# EAGLE schematic ra-08h_development_board_V1.0-20230228 (EAGLE 9.5.1)
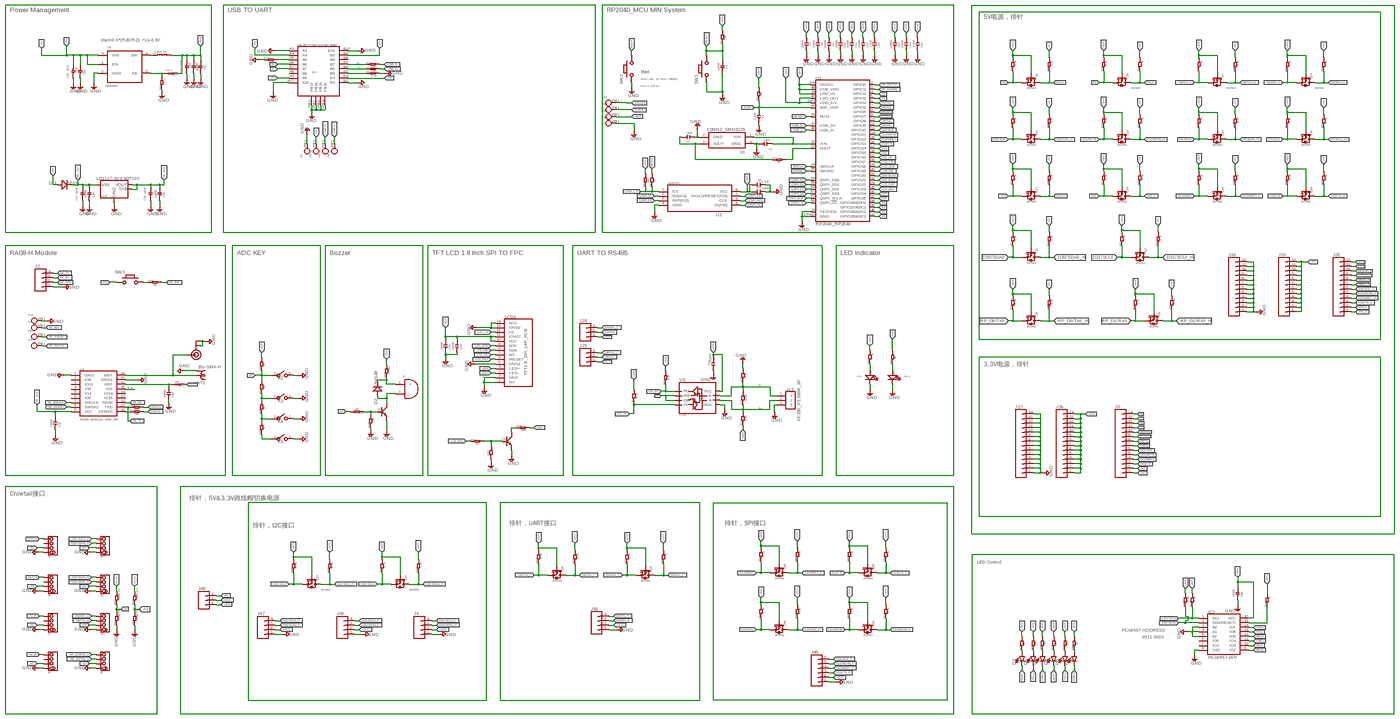
[diagram p0: schematic, sheet 1, overview]
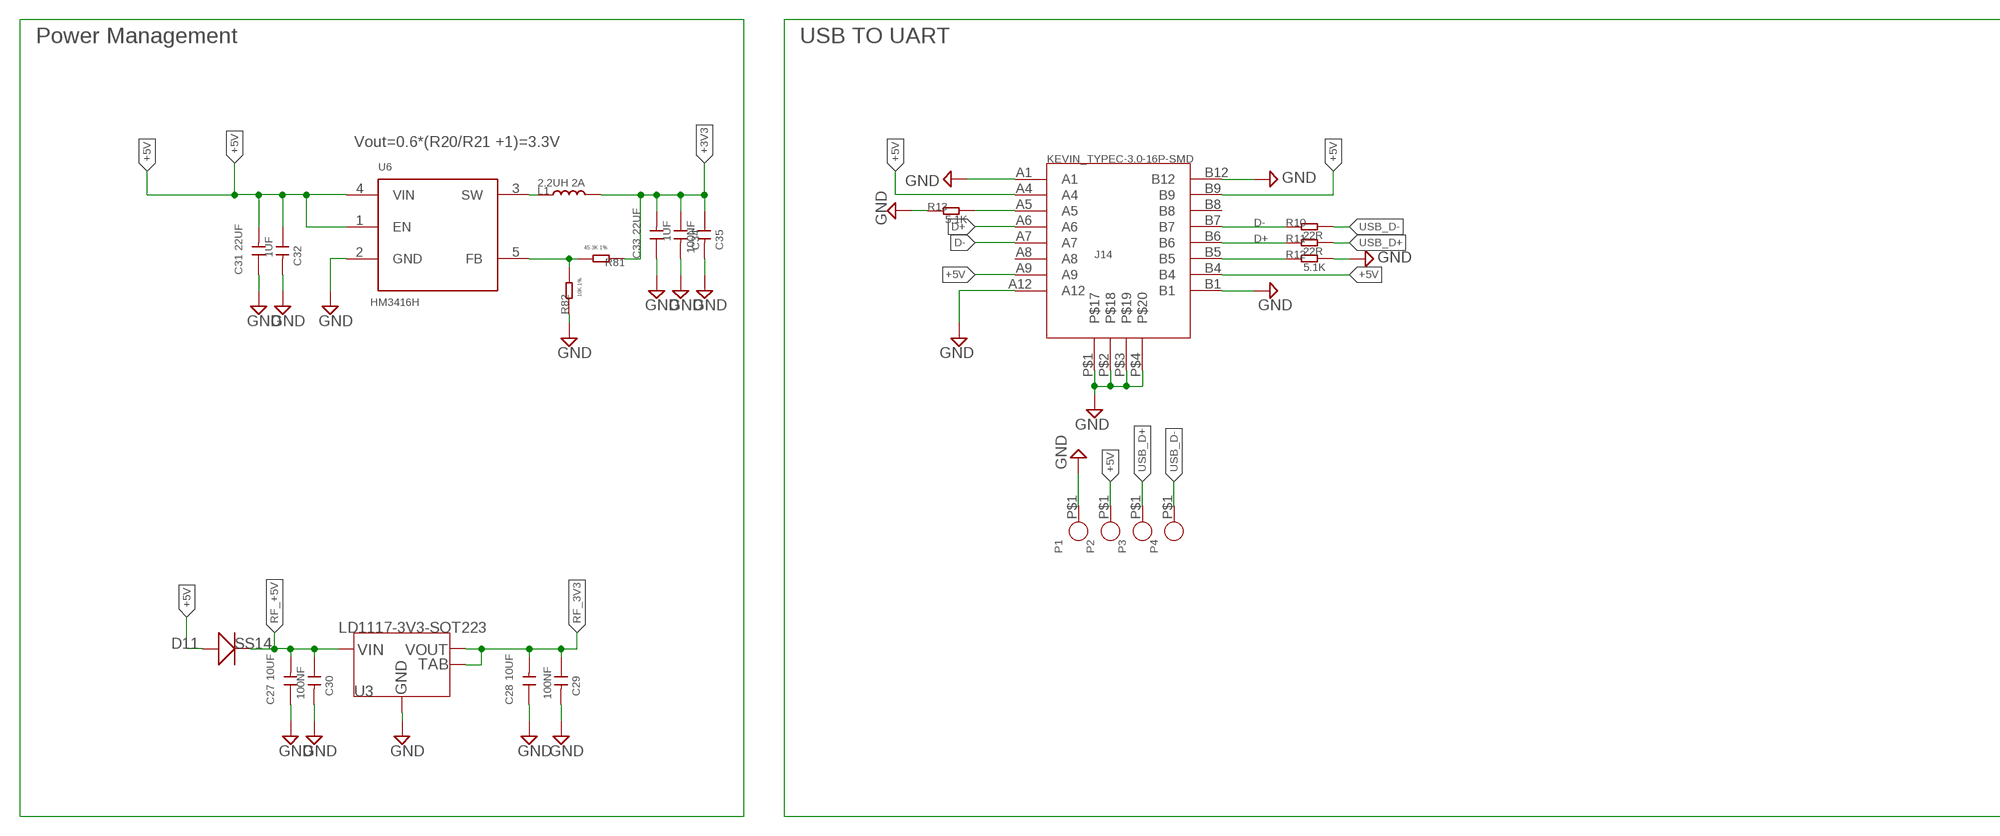
[diagram p1: schematic, sheet 1, part 1 of 6]
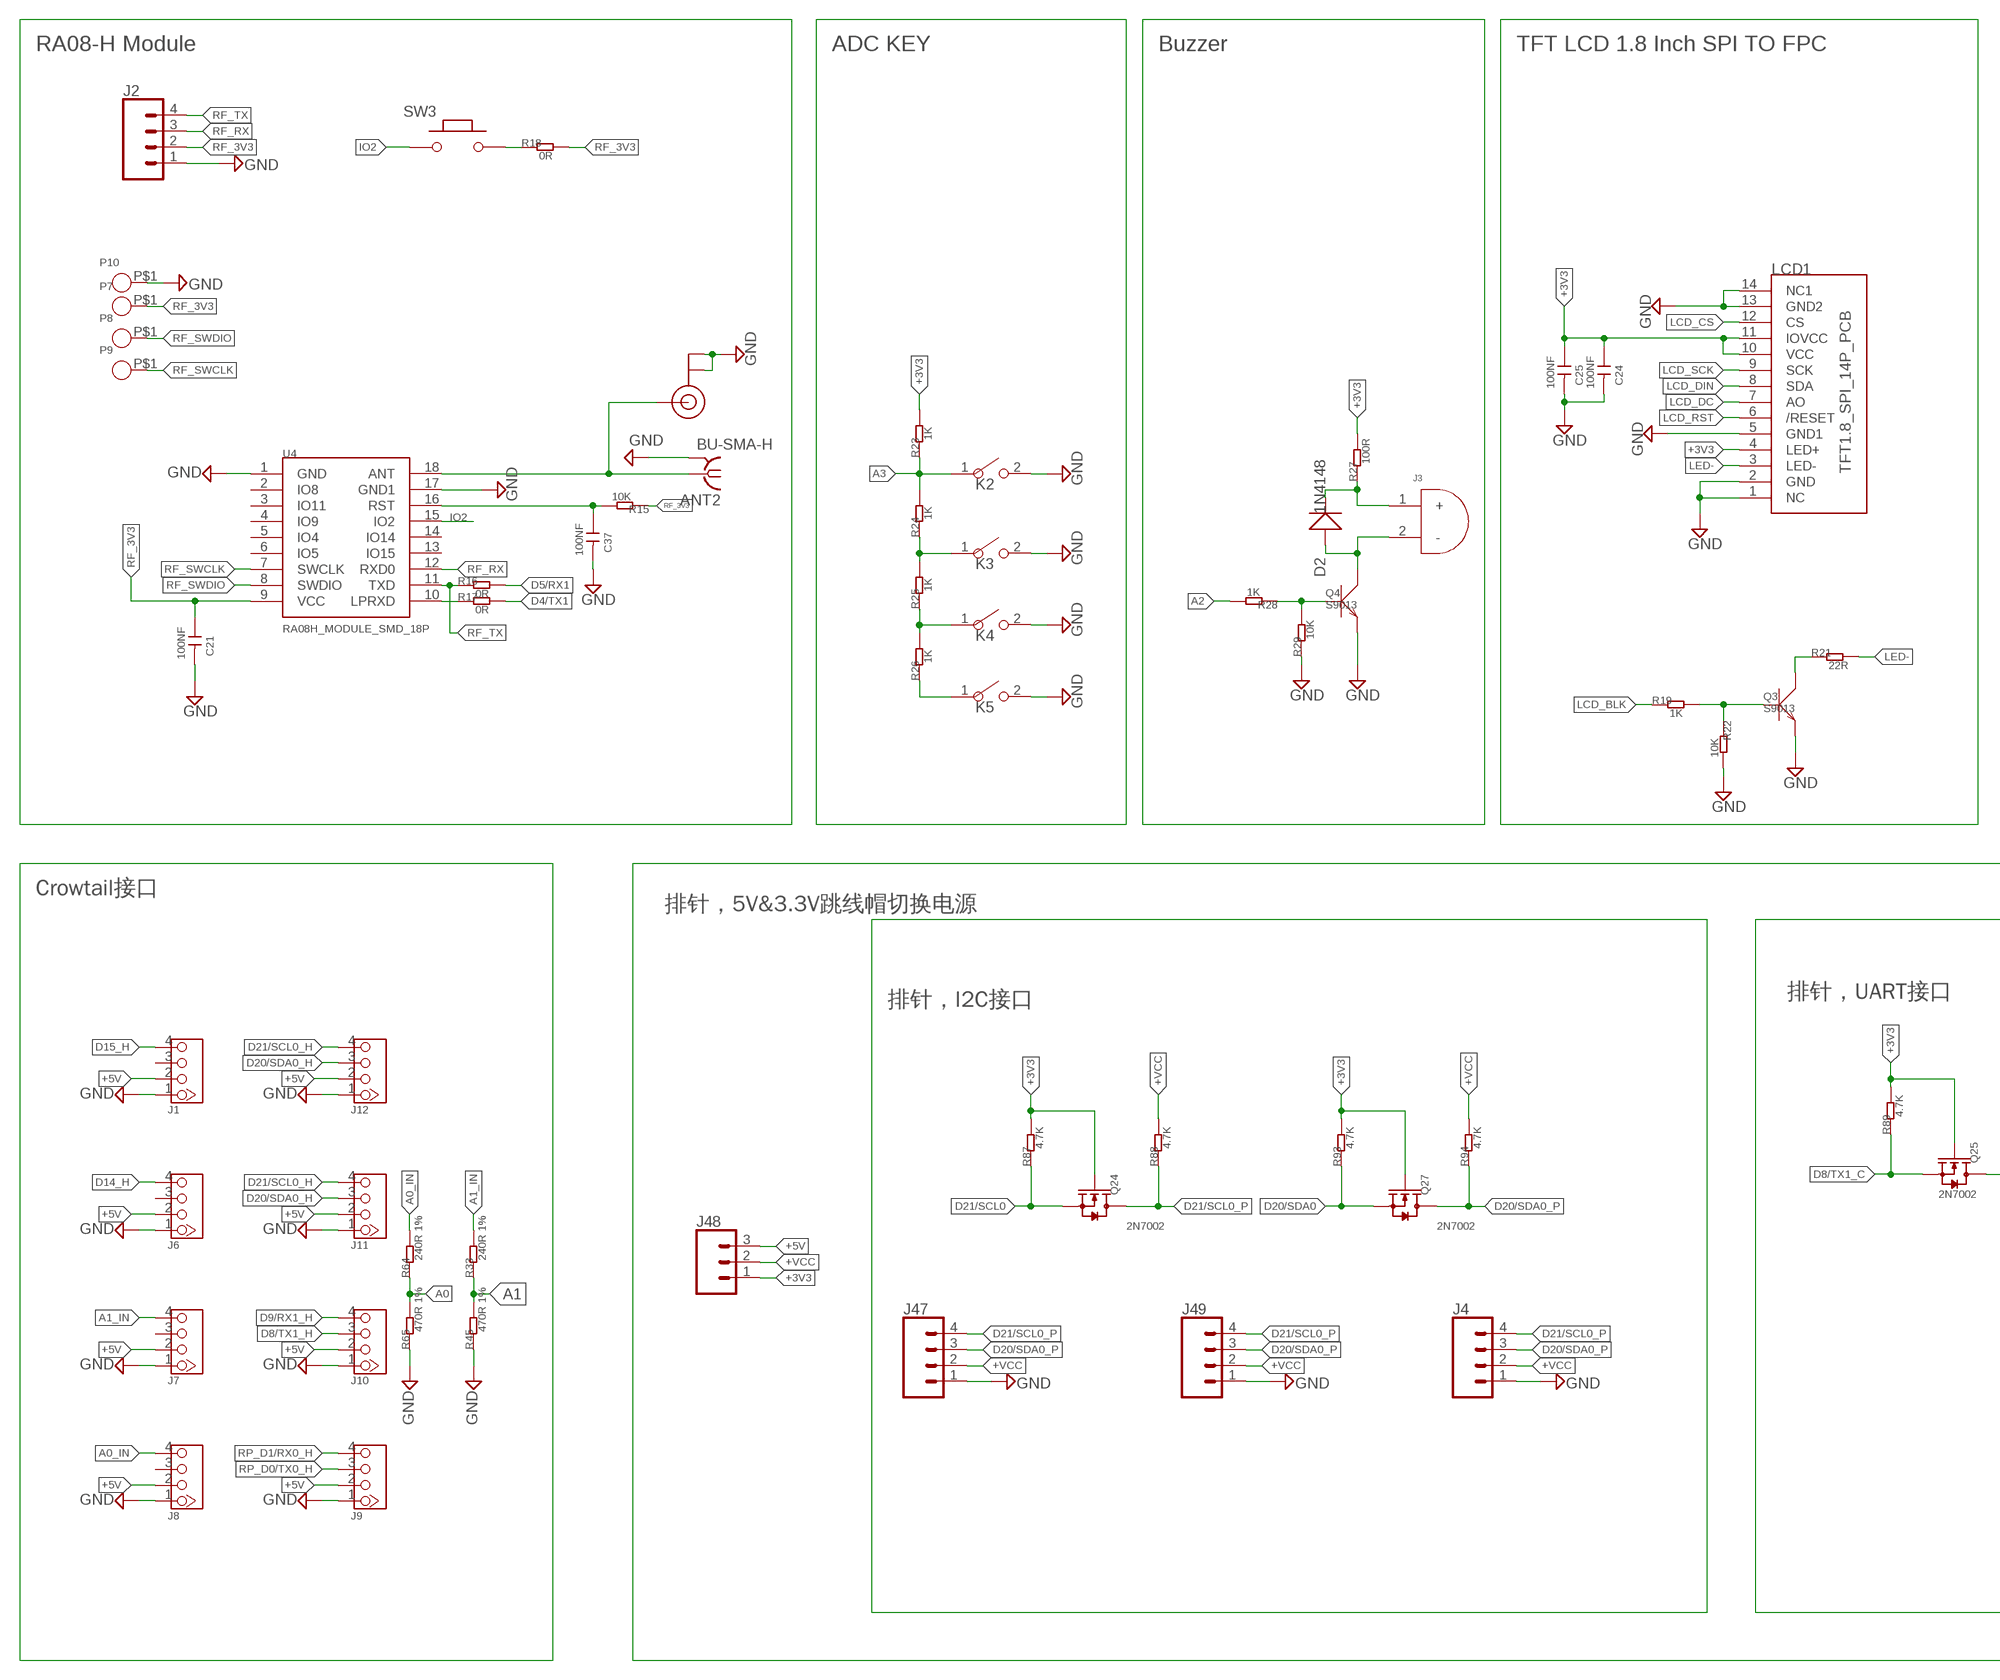
[diagram p2: schematic, sheet 1, part 2 of 6]
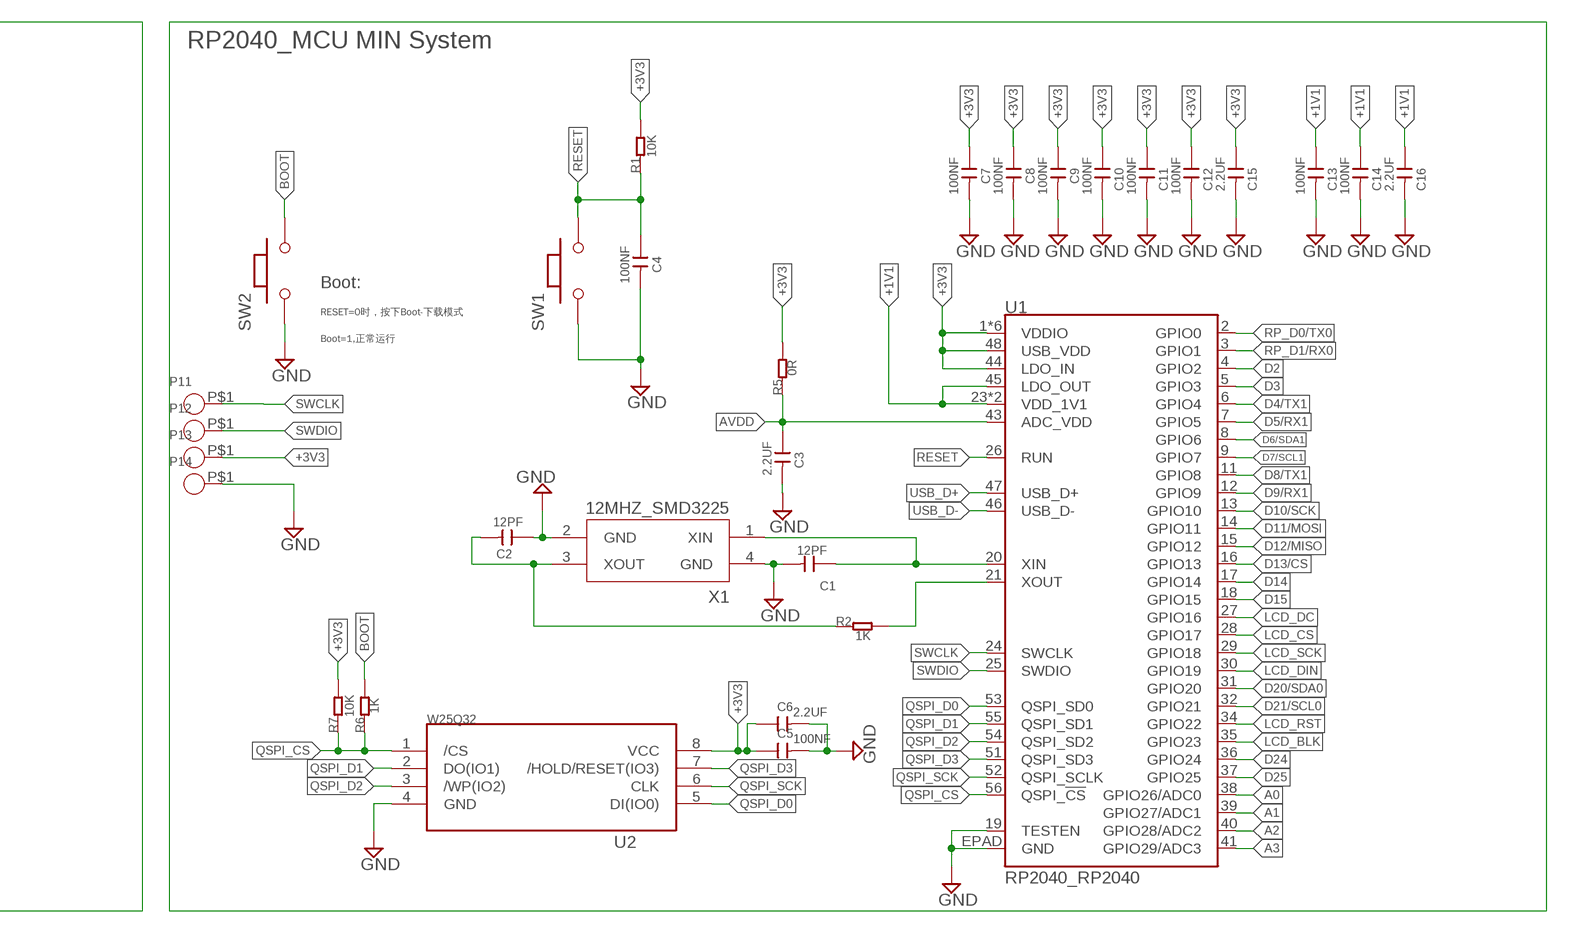
[diagram p3: schematic, sheet 1, part 3 of 6]
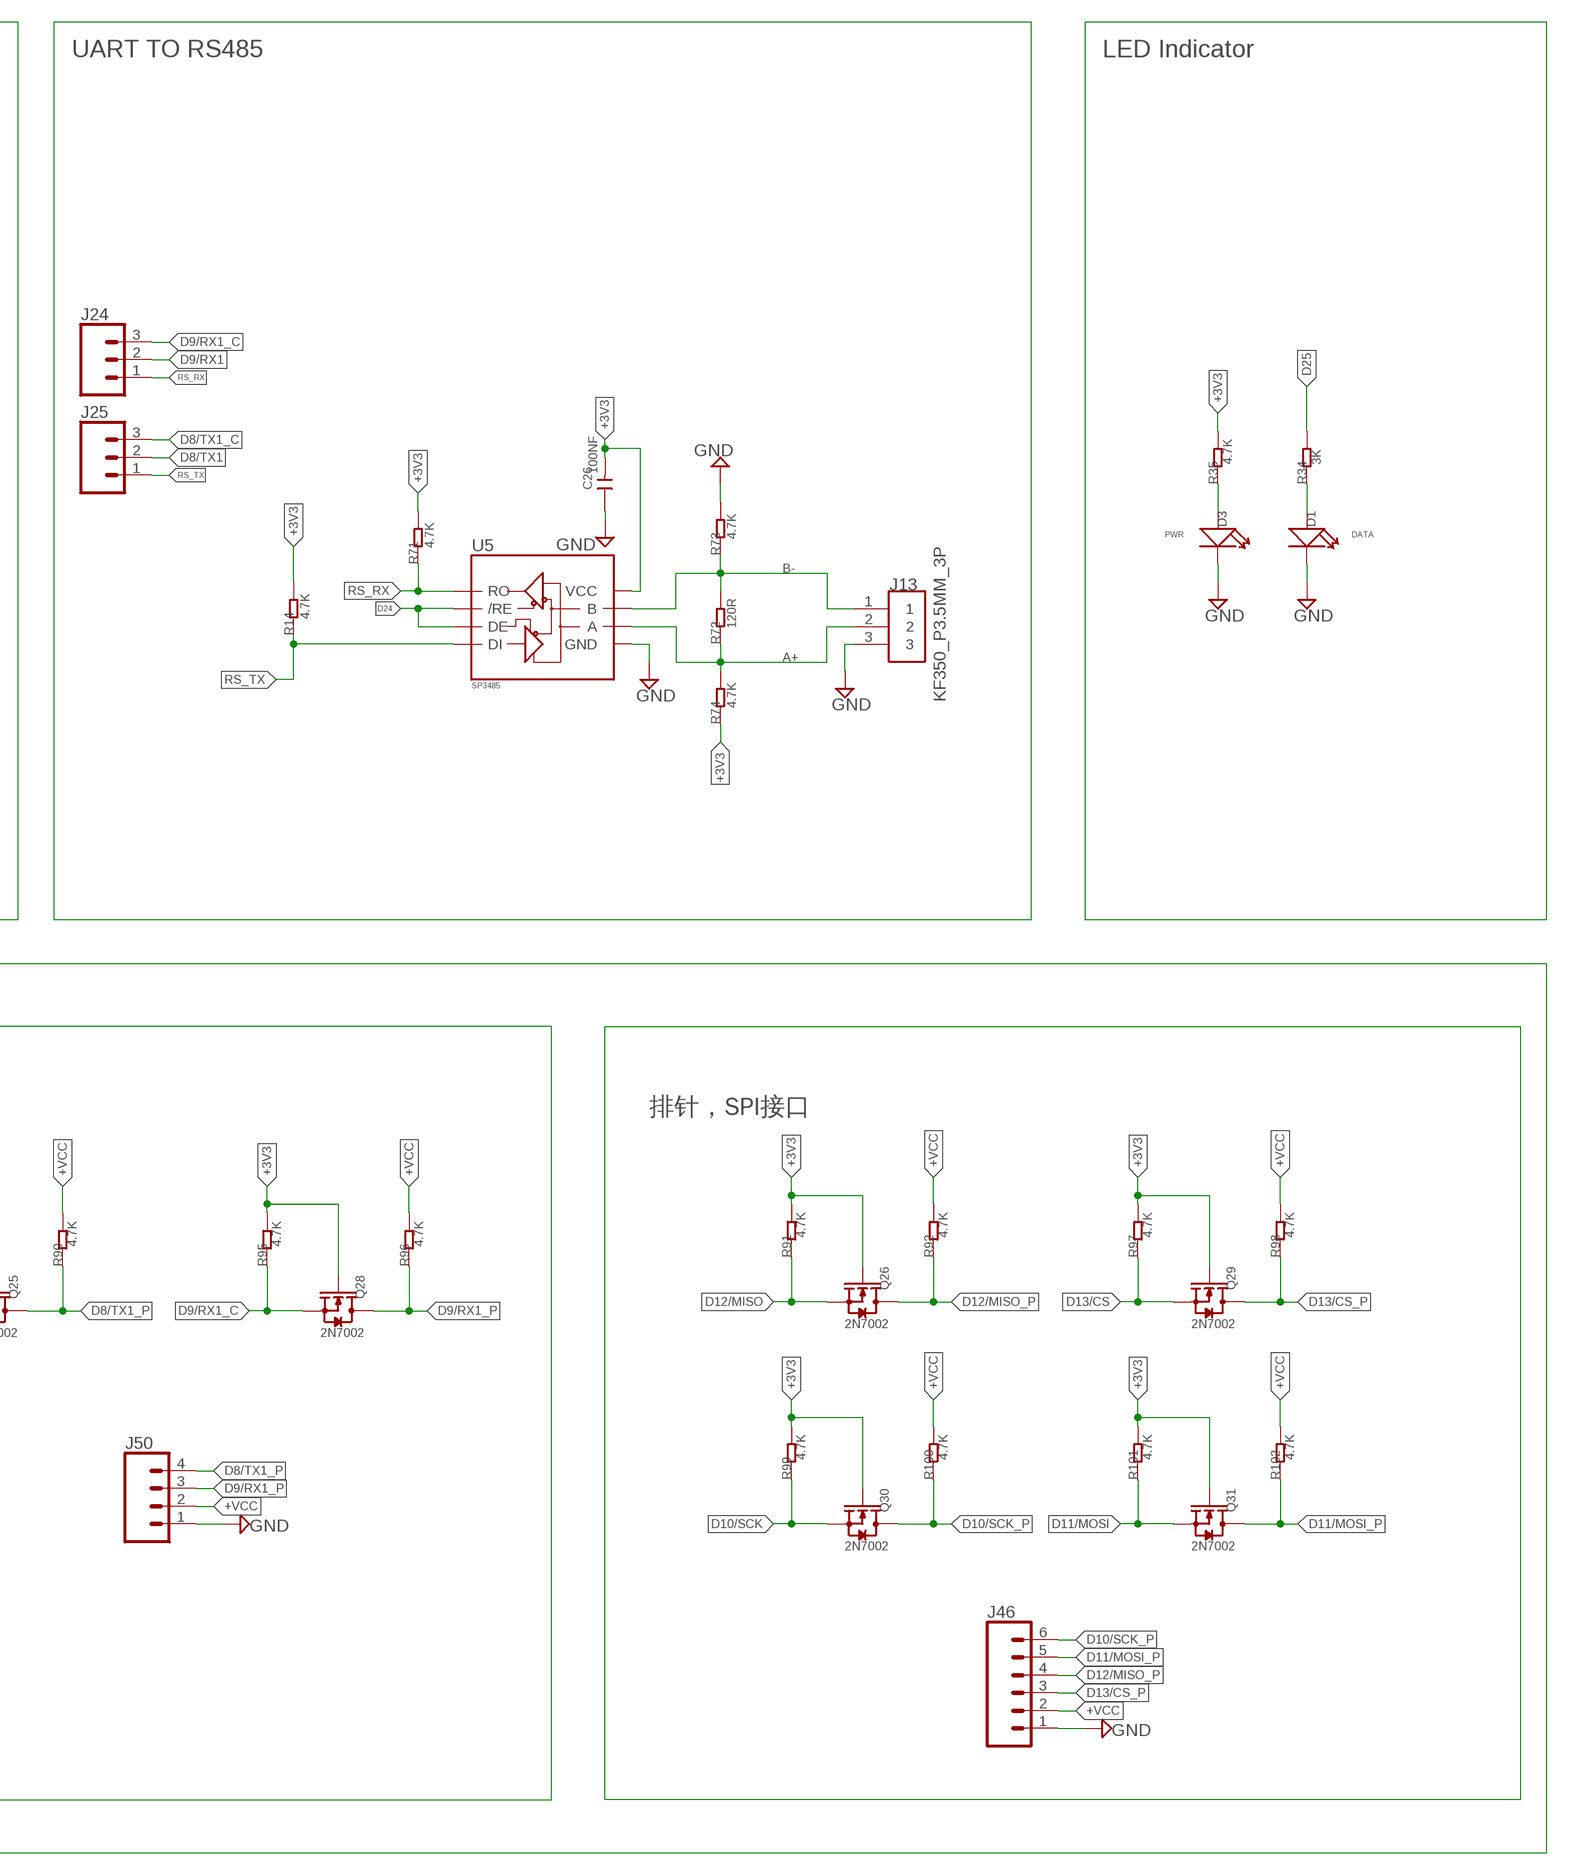
[diagram p4: schematic, sheet 1, part 4 of 6]
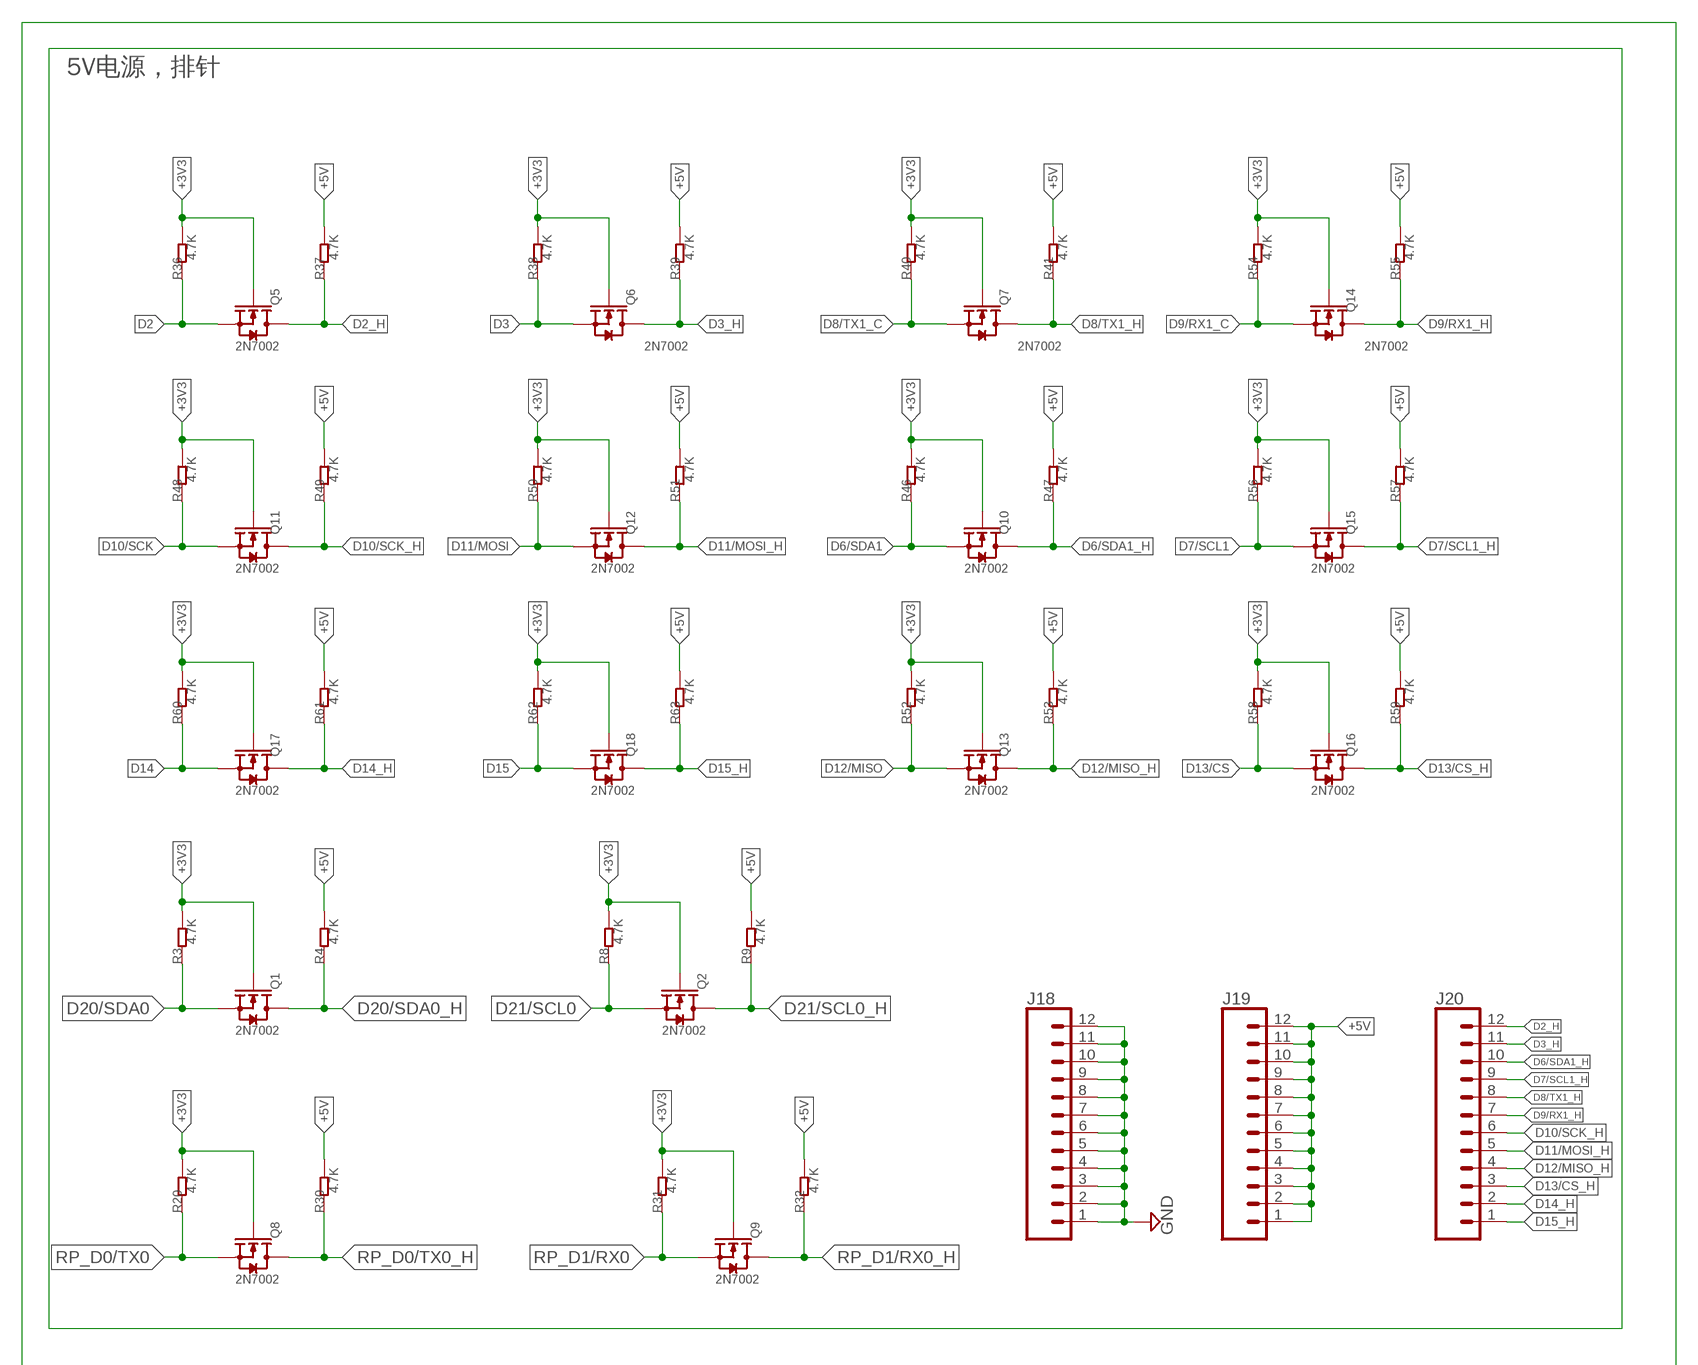
[diagram p5: schematic, sheet 1, part 5 of 6]
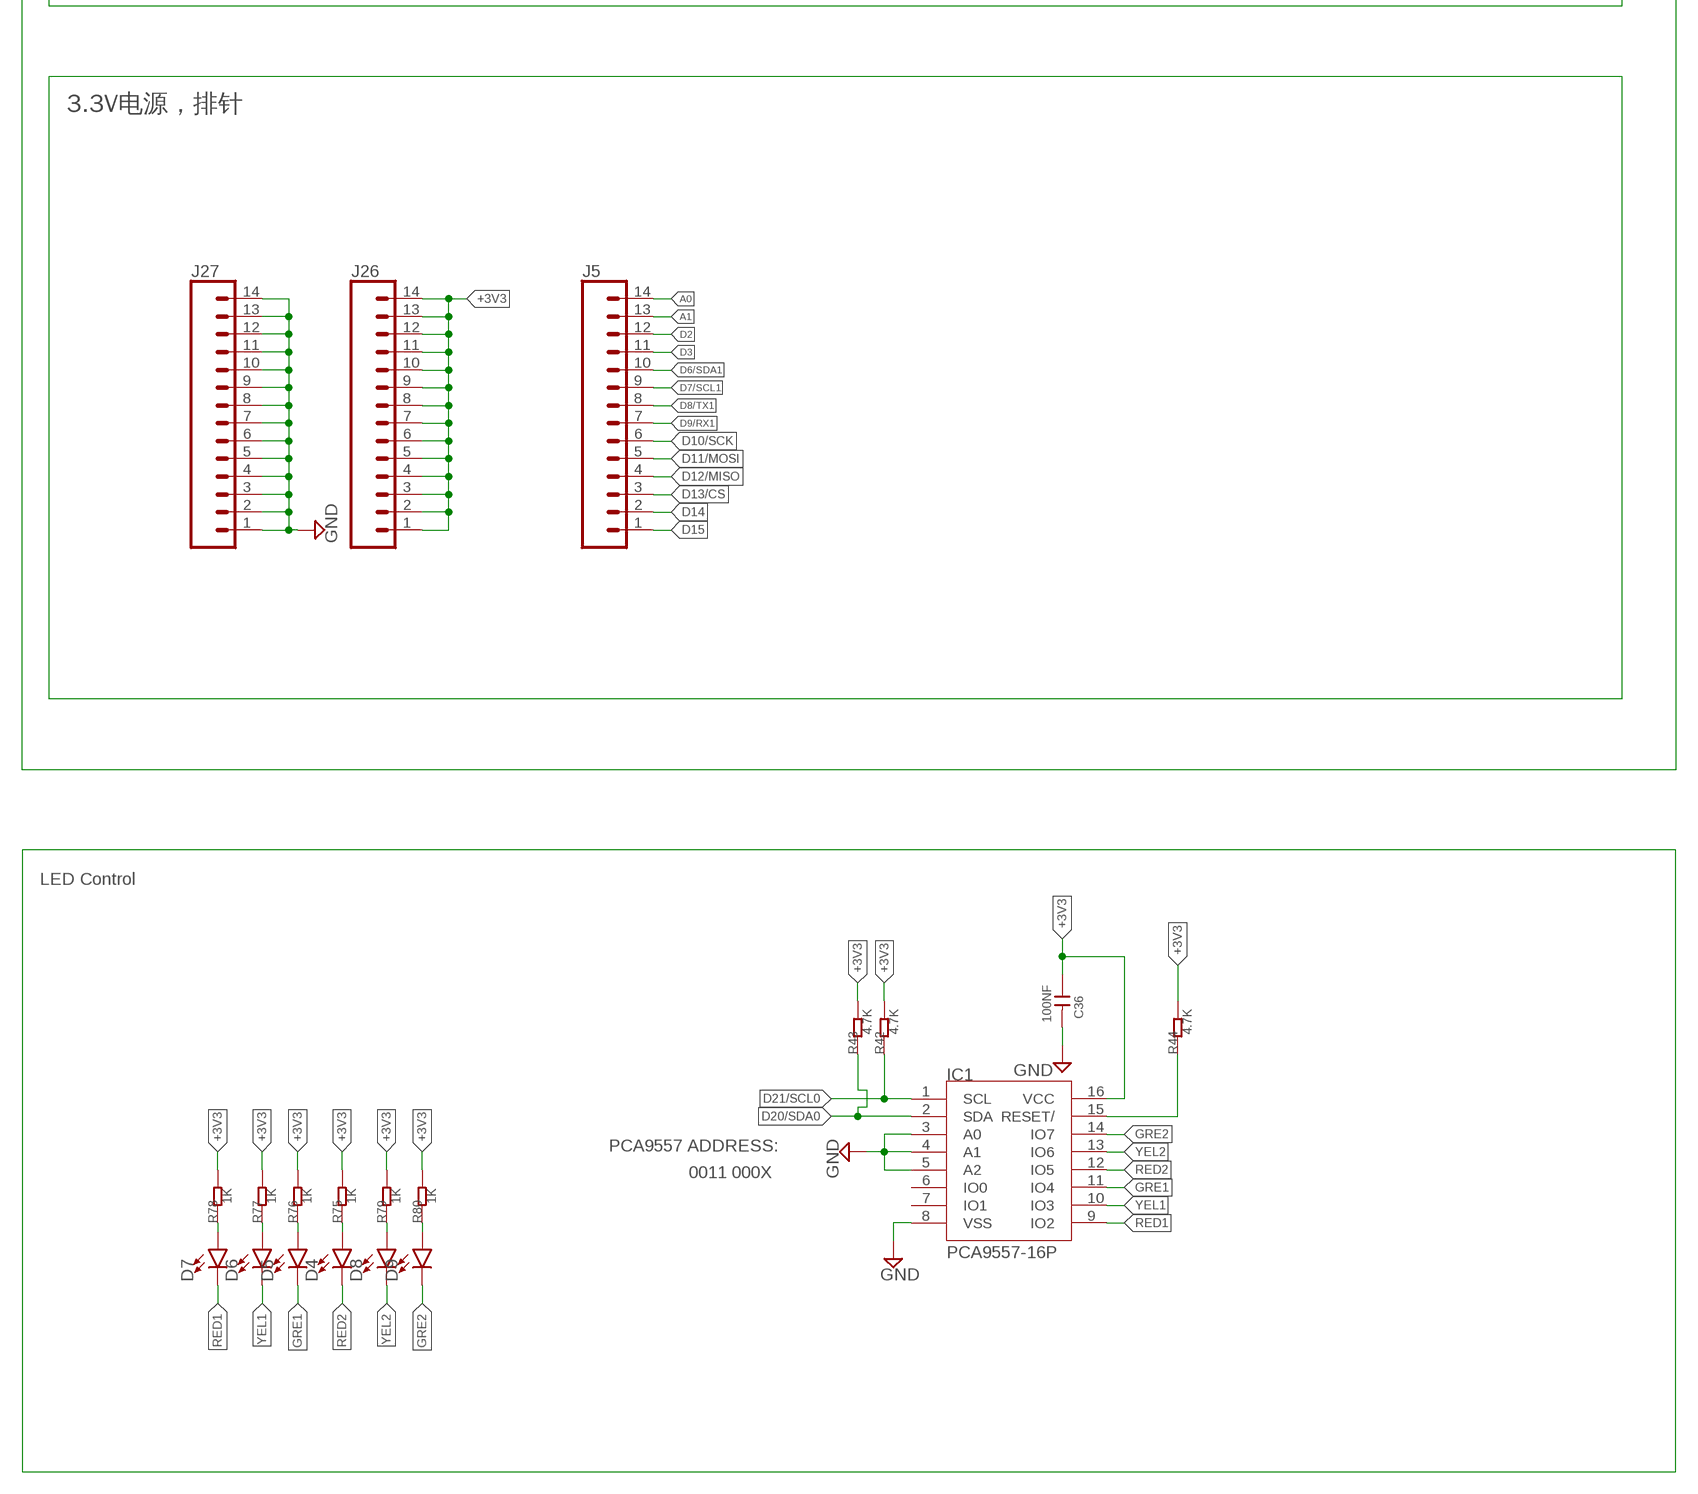
[diagram p6: schematic, sheet 1, part 6 of 6]

## Parts
ANT1  SPARKFUN2_U.FL  [SPARKFUN2_U.FL]
ANT2  BU-SMA-H  [BU-SMA-H]
C1  12PF  A_XBJ_C0603  [A_XBJ_0603]
C2  12PF  A_XBJ_C0603  [A_XBJ_0603]
C3  2.2UF  A_XBJ_C0603  [A_XBJ_0603]
C4  100NF  A_XBJ_C0603  [A_XBJ_0603]
C5  100NF  A_XBJ_C0603  [A_XBJ_0603]
C6  2.2UF  A_XBJ_C0603  [A_XBJ_0603]
C7  100NF  A_XBJ_C0603  [A_XBJ_0603]
C8  100NF  A_XBJ_C0603  [A_XBJ_0603]
C9  100NF  A_XBJ_C0603  [A_XBJ_0603]
C10  100NF  A_XBJ_C0603  [A_XBJ_0603]
C11  100NF  A_XBJ_C0603  [A_XBJ_0603]
C12  100NF  A_XBJ_C0603  [A_XBJ_0603]
C13  100NF  A_XBJ_C0603  [A_XBJ_0603]
C14  100NF  A_XBJ_C0603  [A_XBJ_0603]
C15  2.2UF  A_XBJ_C0603  [A_XBJ_0603]
C16  2.2UF  A_XBJ_C0603  [A_XBJ_0603]
C21  100NF  A_XBJ_C0603  [A_XBJ_0603]
C24  100NF  A_XBJ_C0603  [A_XBJ_0603]
C25  100NF  A_XBJ_C0603  [A_XBJ_0603]
C26  100NF  A_XBJ_C0603  [A_XBJ_0603]
C27  10UF  A_XBJ_C0805  [A_XBJ_0805]
C28  10UF  A_XBJ_C0805  [A_XBJ_0805]
C29  100NF  A_XBJ_C0603  [A_XBJ_0603]
C30  100NF  A_XBJ_C0603  [A_XBJ_0603]
C31  22UF  A_XBJ_C0805  [A_XBJ_0805]
C32  1UF  A_XBJ_C0603  [A_XBJ_0603]
C33  22UF  A_XBJ_C0805  [A_XBJ_0805]
C34  1UF  A_XBJ_C0603  [A_XBJ_0603]
C35  100NF  A_XBJ_C0603  [A_XBJ_0603]
C36  100NF  A_XBJ_C0603  [A_XBJ_0603]
C37  100NF  A_XBJ_C0603  [A_XBJ_0603]
D1  DISCRETE_007-LED0603  [DISCRETE_D0603]
D2  1N4148  DISCRETE_D1N4148-SMD  [DISCRETE_DO-35-SMD]
D3  DISCRETE_007-LED0603  [DISCRETE_D0603]
D4  LED-3MM-NO_SILK  [LED_3MM-NS]
D5  LED-3MM-NO_SILK  [LED_3MM-NS]
D6  LED-3MM-NO_SILK  [LED_3MM-NS]
D7  LED-3MM-NO_SILK  [LED_3MM-NS]
D8  LED-3MM-NO_SILK  [LED_3MM-NS]
D9  LED-3MM-NO_SILK  [LED_3MM-NS]
D11  SS14  DISCRETE_DSMA  [DISCRETE_D2010]
IC1  PCA9557-16P  [TSSOP16]
J1  CONNECTER_TWIG_2.0  [CONNECTER_2.0_1X4]
J2  CONN_04PTH  [1X04]
J3  A_XBJ_MLT-8530  [A_XBJ_MLT-8530]
J4  CONN_04PTH  [1X04]
J5  CONN_14  [1X14]
J6  CONNECTER_TWIG_2.0  [CONNECTER_2.0_1X4]
J7  CONNECTER_TWIG_2.0  [CONNECTER_2.0_1X4]
J8  CONNECTER_TWIG_2.0  [CONNECTER_2.0_1X4]
J9  CONNECTER_TWIG_2.0  [CONNECTER_2.0_1X4]
J10  CONNECTER_TWIG_2.0  [CONNECTER_2.0_1X4]
J11  CONNECTER_TWIG_2.0  [CONNECTER_2.0_1X4]
J12  CONNECTER_TWIG_2.0  [CONNECTER_2.0_1X4]
J13  KF350_P3.5MM_3P  [KF350_P3.5MM_3P]
J14  KEVIN_TYPEC-3.0-16P-SMD  [KEVIN_3.0TYPEC-SMD]
J18  CONN_12  [1X12]
J19  CONN_12  [1X12]
J20  CONN_12  [1X12]
J24  455-1750-1-ND  CONN_03  [1X03]
J25  455-1750-1-ND  CONN_03  [1X03]
J26  CONN_14  [1X14]
J27  CONN_14  [1X14]
J46  CONN_06SILK_FEMALE_PTH  [1X06]
J47  CONN_04PTH  [1X04]
J48  455-1750-1-ND  CONN_03  [1X03]
J49  CONN_04PTH  [1X04]
J50  CONN_04PTH  [1X04]
K2  CROWBO_KEY_2PIN_6.5X3.5  [CROWBOT_-V1.2-20220713_CROWBOT-V1.1库_KEY_EN_2PIN_B/W]
K3  CROWBO_KEY_2PIN_6.5X3.5  [CROWBOT_-V1.2-20220713_CROWBOT-V1.1库_KEY_EN_2PIN_B/W]
K4  CROWBO_KEY_2PIN_6.5X3.5  [CROWBOT_-V1.2-20220713_CROWBOT-V1.1库_KEY_EN_2PIN_B/W]
K5  CROWBO_KEY_2PIN_6.5X3.5  [CROWBOT_-V1.2-20220713_CROWBOT-V1.1库_KEY_EN_2PIN_B/W]
L1  2.2UH 2A  DISCRETE_LL773  [CROWPI_POW_L773]
LCD1  TFT1.8_SPI_14P_PCB  [TFF1.8_SPI_14P_PCB]
P1  CROWPI_POW_PADPAD-1.0MM  [CROWPI_POW_PAD-1.0MM]
P2  CROWPI_POW_PADPAD-1.0MM  [CROWPI_POW_PAD-1.0MM]
P3  CROWPI_POW_PADPAD-1.0MM  [CROWPI_POW_PAD-1.0MM]
P4  CROWPI_POW_PADPAD-1.0MM  [CROWPI_POW_PAD-1.0MM]
P7  CROWPI_POW_PADPAD-1.0MM  [CROWPI_POW_PAD-1.0MM]
P8  CROWPI_POW_PADPAD-1.0MM  [CROWPI_POW_PAD-1.0MM]
P9  CROWPI_POW_PADPAD-1.0MM  [CROWPI_POW_PAD-1.0MM]
P10  CROWPI_POW_PADPAD-1.0MM  [CROWPI_POW_PAD-1.0MM]
P11  CROWPI_POW_PADPAD-1.0MM  [CROWPI_POW_PAD-1.0MM]
P12  CROWPI_POW_PADPAD-1.0MM  [CROWPI_POW_PAD-1.0MM]
P13  CROWPI_POW_PADPAD-1.0MM  [CROWPI_POW_PAD-1.0MM]
P14  CROWPI_POW_PADPAD-1.0MM  [CROWPI_POW_PAD-1.0MM]
Q1  2N7002  DISCRETE_MOSFET-NSOT23  [DISCRETE_SOT23]
Q2  2N7002  DISCRETE_MOSFET-NSOT23  [DISCRETE_SOT23]
Q3  S9013  DISCRETE_TRANSISTOR-NPN-SOT23  [DISCRETE_SOT23$1]
Q4  S9013  DISCRETE_TRANSISTOR-NPN-SOT23  [DISCRETE_SOT23$1]
Q5  2N7002  DISCRETE_MOSFET-NSOT23  [DISCRETE_SOT23]
Q6  2N7002  DISCRETE_MOSFET-NSOT23  [DISCRETE_SOT23]
Q7  2N7002  DISCRETE_MOSFET-NSOT23  [DISCRETE_SOT23]
Q8  2N7002  DISCRETE_MOSFET-NSOT23  [DISCRETE_SOT23]
Q9  2N7002  DISCRETE_MOSFET-NSOT23  [DISCRETE_SOT23]
Q10  2N7002  DISCRETE_MOSFET-NSOT23  [DISCRETE_SOT23]
Q11  2N7002  DISCRETE_MOSFET-NSOT23  [DISCRETE_SOT23]
Q12  2N7002  DISCRETE_MOSFET-NSOT23  [DISCRETE_SOT23]
Q13  2N7002  DISCRETE_MOSFET-NSOT23  [DISCRETE_SOT23]
Q14  2N7002  DISCRETE_MOSFET-NSOT23  [DISCRETE_SOT23]
Q15  2N7002  DISCRETE_MOSFET-NSOT23  [DISCRETE_SOT23]
Q16  2N7002  DISCRETE_MOSFET-NSOT23  [DISCRETE_SOT23]
Q17  2N7002  DISCRETE_MOSFET-NSOT23  [DISCRETE_SOT23]
Q18  2N7002  DISCRETE_MOSFET-NSOT23  [DISCRETE_SOT23]
Q24  2N7002  DISCRETE_MOSFET-NSOT23  [DISCRETE_SOT23]
Q25  2N7002  DISCRETE_MOSFET-NSOT23  [DISCRETE_SOT23]
Q26  2N7002  DISCRETE_MOSFET-NSOT23  [DISCRETE_SOT23]
Q27  2N7002  DISCRETE_MOSFET-NSOT23  [DISCRETE_SOT23]
Q28  2N7002  DISCRETE_MOSFET-NSOT23  [DISCRETE_SOT23]
Q29  2N7002  DISCRETE_MOSFET-NSOT23  [DISCRETE_SOT23]
Q30  2N7002  DISCRETE_MOSFET-NSOT23  [DISCRETE_SOT23]
Q31  2N7002  DISCRETE_MOSFET-NSOT23  [DISCRETE_SOT23]
R1  10K  DISCRETE_R-0603  [DISCRETE_R0603]
R2  1K  DISCRETE_R-0603  [DISCRETE_R0603]
R3  4.7K  DISCRETE_R-0603  [DISCRETE_R0603]
R4  4.7K  DISCRETE_R-0603  [DISCRETE_R0603]
R5  0R  DISCRETE_R-0603  [DISCRETE_R0603]
R6  1K  DISCRETE_R-0603  [DISCRETE_R0603]
R7  10K  DISCRETE_R-0603  [DISCRETE_R0603]
R8  4.7K  DISCRETE_R-0603  [DISCRETE_R0603]
R9  4.7K  DISCRETE_R-0603  [DISCRETE_R0603]
R10  22R  DISCRETE_R-0603  [DISCRETE_R0603]
R11  22R  DISCRETE_R-0603  [DISCRETE_R0603]
R12  5.1K  DISCRETE_R-0603  [DISCRETE_R0603]
R13  5.1K  DISCRETE_R-0603  [DISCRETE_R0603]
R14  4.7K  DISCRETE_R-0603  [DISCRETE_R0603]
R15  10K  DISCRETE_R-0603  [DISCRETE_R0603]
R16  0R  DISCRETE_R-0603  [DISCRETE_R0603]
R17  0R  DISCRETE_R-0603  [DISCRETE_R0603]
R18  0R  DISCRETE_R-0603  [DISCRETE_R0603]
R19  1K  DISCRETE_R-0603  [DISCRETE_R0603]
R20  4.7K  DISCRETE_R-0603  [DISCRETE_R0603]
R21  22R  DISCRETE_R-0603  [DISCRETE_R0603]
R22  10K  DISCRETE_R-0603  [DISCRETE_R0603]
R23  1K  DISCRETE_R-0603  [DISCRETE_R0603]
R24  1K  DISCRETE_R-0603  [DISCRETE_R0603]
R25  1K  DISCRETE_R-0603  [DISCRETE_R0603]
R26  1K  DISCRETE_R-0603  [DISCRETE_R0603]
R27  100R  DISCRETE_R-0603  [DISCRETE_R0603]
R28  1K  DISCRETE_R-0603  [DISCRETE_R0603]
R29  10K  DISCRETE_R-0603  [DISCRETE_R0603]
R30  4.7K  DISCRETE_R-0603  [DISCRETE_R0603]
R31  4.7K  DISCRETE_R-0603  [DISCRETE_R0603]
R32  4.7K  DISCRETE_R-0603  [DISCRETE_R0603]
R33  240R 1%  DISCRETE_R-0603  [DISCRETE_R0603]
R34  3K  DISCRETE_R-0603  [DISCRETE_R0603]
R35  4.7K  DISCRETE_R-0603  [DISCRETE_R0603]
R36  4.7K  DISCRETE_R-0603  [DISCRETE_R0603]
R37  4.7K  DISCRETE_R-0603  [DISCRETE_R0603]
R38  4.7K  DISCRETE_R-0603  [DISCRETE_R0603]
R39  4.7K  DISCRETE_R-0603  [DISCRETE_R0603]
R40  4.7K  DISCRETE_R-0603  [DISCRETE_R0603]
R41  4.7K  DISCRETE_R-0603  [DISCRETE_R0603]
R42  4.7K  DISCRETE_R-0603  [DISCRETE_R0603]
R43  4.7K  DISCRETE_R-0603  [DISCRETE_R0603]
R44  4.7K  DISCRETE_R-0603  [DISCRETE_R0603]
R45  470R 1%  DISCRETE_R-0603  [DISCRETE_R0603]
R46  4.7K  DISCRETE_R-0603  [DISCRETE_R0603]
R47  4.7K  DISCRETE_R-0603  [DISCRETE_R0603]
R48  4.7K  DISCRETE_R-0603  [DISCRETE_R0603]
R49  4.7K  DISCRETE_R-0603  [DISCRETE_R0603]
R50  4.7K  DISCRETE_R-0603  [DISCRETE_R0603]
R51  4.7K  DISCRETE_R-0603  [DISCRETE_R0603]
R52  4.7K  DISCRETE_R-0603  [DISCRETE_R0603]
R53  4.7K  DISCRETE_R-0603  [DISCRETE_R0603]
R54  4.7K  DISCRETE_R-0603  [DISCRETE_R0603]
R55  4.7K  DISCRETE_R-0603  [DISCRETE_R0603]
R56  4.7K  DISCRETE_R-0603  [DISCRETE_R0603]
R57  4.7K  DISCRETE_R-0603  [DISCRETE_R0603]
R58  4.7K  DISCRETE_R-0603  [DISCRETE_R0603]
R59  4.7K  DISCRETE_R-0603  [DISCRETE_R0603]
R60  4.7K  DISCRETE_R-0603  [DISCRETE_R0603]
R61  4.7K  DISCRETE_R-0603  [DISCRETE_R0603]
R62  4.7K  DISCRETE_R-0603  [DISCRETE_R0603]
R63  4.7K  DISCRETE_R-0603  [DISCRETE_R0603]
R64  240R 1%  DISCRETE_R-0603  [DISCRETE_R0603]
R65  470R 1%  DISCRETE_R-0603  [DISCRETE_R0603]
R71  4.7K  DISCRETE_R-0603  [DISCRETE_R0603]
R72  120R  DISCRETE_R-0603  [DISCRETE_R0603]
R73  4.7K  DISCRETE_R-0603  [DISCRETE_R0603]
R74  4.7K  DISCRETE_R-0603  [DISCRETE_R0603]
R75  1K  DISCRETE_R-0603  [DISCRETE_R0603]
R76  1K  DISCRETE_R-0603  [DISCRETE_R0603]
R77  1K  DISCRETE_R-0603  [DISCRETE_R0603]
R78  1K  DISCRETE_R-0603  [DISCRETE_R0603]
R79  1K  DISCRETE_R-0603  [DISCRETE_R0603]
R80  1K  DISCRETE_R-0603  [DISCRETE_R0603]
R81  45.3K 1%  DISCRETE_R-0603  [DISCRETE_R0603]
R82  10K 1%  DISCRETE_R-0603  [DISCRETE_R0603]
R87  4.7K  DISCRETE_R-0603  [DISCRETE_R0603]
R88  4.7K  DISCRETE_R-0603  [DISCRETE_R0603]
R89  4.7K  DISCRETE_R-0603  [DISCRETE_R0603]
R90  4.7K  DISCRETE_R-0603  [DISCRETE_R0603]
R91  4.7K  DISCRETE_R-0603  [DISCRETE_R0603]
R92  4.7K  DISCRETE_R-0603  [DISCRETE_R0603]
R93  4.7K  DISCRETE_R-0603  [DISCRETE_R0603]
R94  4.7K  DISCRETE_R-0603  [DISCRETE_R0603]
R95  4.7K  DISCRETE_R-0603  [DISCRETE_R0603]
R96  4.7K  DISCRETE_R-0603  [DISCRETE_R0603]
R97  4.7K  DISCRETE_R-0603  [DISCRETE_R0603]
R98  4.7K  DISCRETE_R-0603  [DISCRETE_R0603]
R99  4.7K  DISCRETE_R-0603  [DISCRETE_R0603]
R100  4.7K  DISCRETE_R-0603  [DISCRETE_R0603]
R101  4.7K  DISCRETE_R-0603  [DISCRETE_R0603]
R102  4.7K  DISCRETE_R-0603  [DISCRETE_R0603]
SW1  MYSMD_PB157_4.3X3  [MYSMD_157SW]
SW2  MYSMD_PB157_4.3X3  [MYSMD_157SW]
SW3  MYSMD_PB157_4.3X3  [MYSMD_157SW]
U1  RP2040_RP2040  [RP2040_QFN-56]
U2  SELF_W25Q128JV  [SELF_SOIC-8-208MIL]
U3  LD1117-3V3-SOT223  [SOT223]
U4  RA08H_MODULE_SMD_18P  [RA08H_MODULE_SMT_18P]
U5  MAX3485CSA  RS485SOIC  [SO08]
U6  HM3416H  CROWBOT_-V1.0-20220525_A_XBJ_HM3420B  [CROWBOT_-V1.0-20220525_A_XBJ_SOT23-5]
X1  12MHZ_SMD3225  A_XBJ_XTAL  [A_XBJ_SMD3225]

## Nets
+1V1: C13.1 C14.1 C16.1 U1.23(VDD_1V1) U1.45(LDO_OUT) U1.50(VDD_1V1)
+3V3: C5.1 C6.1 C7.1 C8.1 C9.1 C10.1 C11.1 C12.1 C15.1 C24.1 C25.1 C26.2 C33.2 C34.1 C35.1 C36.1 IC1.16(VCC) J26.1 J26.2 J26.3 J26.4 J26.5 J26.6 J26.7 J26.8 J26.9 J26.10 J26.11 J26.12 J26.13 J26.14 J48.1 L1.2 LCD1.4(LED+) LCD1.10(VCC) LCD1.11(IOVCC) P13.P$1 Q1.1(G) Q2.1(G) Q5.1(G) Q6.1(G) Q7.1(G) Q8.1(G) Q9.1(G) Q10.1(G) Q11.1(G) Q12.1(G) Q13.1(G) Q14.1(G) Q15.1(G) Q16.1(G) Q17.1(G) Q18.1(G) Q24.1(G) Q25.1(G) Q26.1(G) Q27.1(G) Q28.1(G) Q29.1(G) Q30.1(G) Q31.1(G) R1.2 R3.2 R5.2 R7.2 R8.2 R14.2 R20.2 R23.2 R27.2 R31.2 R35.2 R36.2 R38.2 R40.2 R42.2 R43.2 R44.2 R46.2 R48.2 R50.2 R52.2 R54.2 R56.2 R58.2 R60.2 R62.2 R71.2 R74.1 R75.2 R76.2 R77.2 R78.2 R79.2 R80.2 R81.1 R87.2 R89.2 R91.2 R93.2 R95.2 R97.2 R99.2 R101.2 U1.1(VDDIO) U1.10(VDDIO) U1.22(VDDIO) U1.33(VDDIO) U1.42(VDDIO) U1.44(LDO_IN) U1.48(USB_VDD) U1.49(VDDIO) U2.8(VCC) U5.8(VCC)
+5V [PWR]: C31.2 C32.1 D11.+ J1.2 J6.2 J7.2 J8.2 J9.2 J10.2 J11.2 J12.2 J14.A4 J14.A9 J14.B4 J14.B9 J19.1 J19.2 J19.3 J19.4 J19.5 J19.6 J19.7 J19.8 J19.9 J19.10 J19.11 J19.12 J48.3 P2.P$1 R4.2 R9.2 R30.2 R32.2 R37.2 R39.2 R41.2 R47.2 R49.2 R51.2 R53.2 R55.2 R57.2 R59.2 R61.2 R63.2 U6.1(EN) U6.4(VIN)
+VCC [PWR]: J4.2 J46.2 J47.2 J48.2 J49.2 J50.2 R88.2 R90.2 R92.2 R94.2 R96.2 R98.2 R100.2 R102.2
A0: J5.14 R64.1 R65.2 U1.38(GPIO26/ADC0)
A0_IN: J8.4 R64.2
A1: J5.13 R33.1 R45.2 U1.39(GPIO27/ADC1)
A1_IN: J7.4 R33.2
A2: R28.2 U1.40(GPIO28/ADC2)
A3: K2.1 R23.1 R24.2 U1.41(GPIO29/ADC3)
A+ [RS485]: J13.2 R72.1 R74.2 U5.6(A)
AVDD: C3.1 R5.1 U1.43(ADC_VDD)
B- [RS485]: J13.1 R72.2 R73.1 U5.7(B)
BOOT: R6.2 SW2.2
D2: J5.12 Q5.2(S) R36.1 U1.4(GPIO2)
D2_H: J20.12 Q5.3(D) R37.1
D3: J5.11 Q6.2(S) R38.1 U1.5(GPIO3)
D3_H: J20.11 Q6.3(D) R39.1
D4/TX1: R17.2 U1.6(GPIO4)
D5/RX1: R16.2 U1.7(GPIO5)
D6/SDA1: J5.10 Q10.2(S) R46.1 U1.8(GPIO6)
D6/SDA1_H: J20.10 Q10.3(D) R47.1
D7/SCL1: J5.9 Q15.2(S) R56.1 U1.9(GPIO7)
D7/SCL1_H: J20.9 Q15.3(D) R57.1
D8/TX1: J5.8 J25.2 U1.11(GPIO8)
D8/TX1_C: J25.3 Q7.2(S) Q25.2(S) R40.1 R89.1
D8/TX1_H: J10.3 J20.8 Q7.3(D) R41.1
D8/TX1_P: J50.4 Q25.3(D) R90.1
D9/RX1: J5.7 J24.2 U1.12(GPIO9)
D9/RX1_C: J24.3 Q14.2(S) Q28.2(S) R54.1 R95.1
D9/RX1_H: J10.4 J20.7 Q14.3(D) R55.1
D9/RX1_P: J50.3 Q28.3(D) R96.1
D10/SCK: J5.6 Q11.2(S) Q30.2(S) R48.1 R99.1 U1.13(GPIO10)
D10/SCK_H: J20.6 Q11.3(D) R49.1
D10/SCK_P: J46.6 Q30.3(D) R100.1
D11/MOSI: J5.5 Q12.2(S) Q31.2(S) R50.1 R101.1 U1.14(GPIO11)
D11/MOSI_H: J20.5 Q12.3(D) R51.1
D11/MOSI_P: J46.5 Q31.3(D) R102.1
D12/MISO: J5.4 Q13.2(S) Q26.2(S) R52.1 R91.1 U1.15(GPIO12)
D12/MISO_H: J20.4 Q13.3(D) R53.1
D12/MISO_P: J46.4 Q26.3(D) R92.1
D13/CS: J5.3 Q16.2(S) Q29.2(S) R58.1 R97.1 U1.16(GPIO13)
D13/CS_H: J20.3 Q16.3(D) R59.1
D13/CS_P: J46.3 Q29.3(D) R98.1
D14: J5.2 Q17.2(S) R60.1 U1.17(GPIO14)
D14_H: J6.4 J20.2 Q17.3(D) R61.1
D15: J5.1 Q18.2(S) R62.1 U1.18(GPIO15)
D15_H: J1.4 J20.1 Q18.3(D) R63.1
D20/SDA0: IC1.2(SDA) Q1.2(S) Q27.2(S) R3.1 R43.1 R93.1 U1.31(GPIO20)
D20/SDA0_H: J11.3 J12.3 Q1.3(D) R4.1
D20/SDA0_P: J4.3 J47.3 J49.3 Q27.3(D) R94.1
D21/SCL0: IC1.1(SCL) Q2.2(S) Q24.2(S) R8.1 R42.1 R87.1 U1.32(GPIO21)
D21/SCL0_H: J11.4 J12.4 Q2.3(D) R9.1
D21/SCL0_P: J4.4 J47.4 J49.4 Q24.3(D) R88.1
D24: U1.36(GPIO24) U5.2(/RE) U5.3(DE)
D25: R34.2 U1.37(GPIO25)
D+ [USB]: J14.A6 J14.B6 R11.1
D- [USB]: J14.A7 J14.B7 R10.1
GND [GND]: ANT1.P$1(GND) ANT1.P$2(GND) ANT2.2 ANT2.3 ANT2.4 ANT2.5 C1.2 C2.1 C3.2 C4.2 C5.2 C6.2 C7.2 C8.2 C9.2 C10.2 C11.2 C12.2 C13.2 C14.2 C15.2 C16.2 C21.2 C24.2 C25.2 C26.1 C27.1 C28.1 C29.2 C30.2 C31.1 C32.2 C33.1 C34.2 C35.2 C36.2 C37.2 D1.- D3.- IC1.3(A0) IC1.4(A1) IC1.5(A2) IC1.8(VSS) J1.1 J2.1 J4.1 J6.1 J7.1 J8.1 J9.1 J10.1 J11.1 J12.1 J13.3 J14.A1 J14.A12 J14.B1 J14.B12 J14.P$1 J14.P$2 J14.P$3 J14.P$4 J18.1 J18.2 J18.3 J18.4 J18.5 J18.6 J18.7 J18.8 J18.9 J18.10 J18.11 J18.12 J27.1 J27.2 J27.3 J27.4 J27.5 J27.6 J27.7 J27.8 J27.9 J27.10 J27.11 J27.12 J27.13 J27.14 J46.1 J47.1 J49.1 J50.1 K2.2 K3.2 K4.2 K5.2 LCD1.1(NC) LCD1.2(GND) LCD1.5(GND1) LCD1.13(GND2) LCD1.14(NC1) P1.P$1 P10.P$1 P14.P$1 Q3.2(E) Q4.2(E) R12.2 R13.1 R22.2 R29.1 R45.1 R65.1 R73.2 R82.1 SW1.1 SW2.1 U1.19(TESTEN) U1.EPAD(GND) U2.4(GND) U3.1(GND) U4.1(GND) U4.17(GND1) U5.5(GND) U6.2(GND) X1.2(GND) X1.4(GND)
GRE1: D5.K(C) IC1.11(IO4)
GRE2: D9.K(C) IC1.14(IO7)
IO2: SW3.1 U4.15(IO2)
LCD_BLK: R19.1 U1.35(GPIO23)
LCD_CS: LCD1.12(CS) U1.28(GPIO17)
LCD_DC: LCD1.7(AO) U1.27(GPIO16)
LCD_DIN: LCD1.8(SDA) U1.30(GPIO19)
LCD_RST: LCD1.6(/RESET) U1.34(GPIO22)
LCD_SCK: LCD1.9(SCK) U1.29(GPIO18)
LED-: LCD1.3(LED-) R21.2
N$1: C2.2 R2.1 X1.3(XOUT)
N$2: R2.2 U1.21(XOUT)
N$3: C1.1 U1.20(XIN) X1.1(XIN)
N$4: R18.1 SW3.2
N$8: C37.1 R15.2 U4.16(RST)
N$10: L1.1 U6.3(SW)
N$12: J14.B5 R12.1
N$14: J14.A5 R13.2
N$17 [ANT]: ANT1.P$3(SIGNAL) ANT2.1 U4.18(ANT)
N$19: Q3.3(C) R21.1
N$21: R17.1 U4.10(LPRXD)
N$23: Q4.1(B) R28.1 R29.2
N$25: K3.1 R24.1 R25.2
N$26: K4.1 R25.1 R26.2
N$27: K5.1 R26.1
N$29: D2.A(+) J3.2(-) Q4.3(C)
N$30: D2.C(-) J3.1(+) R27.1
N$31: Q3.1(B) R19.2 R22.1
N$34: D1.+ R34.1
N$35: D3.+ R35.1
N$43: R81.2 R82.2 U6.5(FB)
N$47: D4.A R75.1
N$49: D5.A R76.1
N$50: D6.A R77.1
N$51: D7.A R78.1
N$52: D8.A R79.1
N$53: D9.A R80.1
N$66: IC1.15(RESET/) R44.1
QSPI_CS: R6.1 R7.1 U1.56(QSPI_!CS!) U2.1(/CS)
QSPI_D0: U1.53(QSPI_SD0) U2.5(DI(IO0))
QSPI_D1: U1.55(QSPI_SD1) U2.2(DO(IO1))
QSPI_D2: U1.54(QSPI_SD2) U2.3(/WP(IO2))
QSPI_D3: U1.51(QSPI_SD3) U2.7(/HOLD/RESET(IO3))
QSPI_SCK: U1.52(QSPI_SCLK) U2.6(CLK)
RED1: D7.K(C) IC1.9(IO2)
RED2: D4.K(C) IC1.12(IO5)
RESET: C4.1 R1.1 SW1.2 U1.26(RUN)
RF_3V3: C21.1 C28.2 C29.1 J2.2 P7.P$1 R15.1 R18.2 U3.2(VOUT) U3.4(TAB) U4.9(VCC)
RF_+5V: C27.2 C30.1 D11.- U3.3(VIN)
RF_RX: J2.3 U4.12(RXD0)
RF_SWCLK: P9.P$1 U4.7(SWCLK)
RF_SWDIO: P8.P$1 U4.8(SWDIO)
RF_TX: J2.4 R16.1 U4.11(TXD)
RP_D0/TX0: Q8.2(S) R20.1 U1.2(GPIO0)
RP_D0/TX0_H: J9.3 Q8.3(D) R30.1
RP_D1/RX0: Q9.2(S) R31.1 U1.3(GPIO1)
RP_D1/RX0_H: J9.4 Q9.3(D) R32.1
RS_RX: J24.1 R71.1 U5.1(RO)
RS_TX: J25.1 R14.1 U5.4(DI)
SWCLK: P11.P$1 U1.24(SWCLK)
SWDIO: P12.P$1 U1.25(SWDIO)
USB_D+ [USB]: P3.P$1 R11.2 U1.47(USB_D+)
USB_D- [USB]: P4.P$1 R10.2 U1.46(USB_D-)
YEL1: D6.K(C) IC1.10(IO3)
YEL2: D8.K(C) IC1.13(IO6)
Unconnected: IC1.6(IO0) IC1.7(IO1) J1.3 J6.3 J7.3 J8.3 J14.A8 J14.B8 U4.2(IO8) U4.3(IO11) U4.4(IO9) U4.5(IO4) U4.6(IO5) U4.13(IO15) U4.14(IO14)

## Notes on the sheet
- Power Management | USB TO UART | RP2040_MCU MIN System
- 5V电源，排针
- Vout=0.6*(R20/R21 +1)=3.3V
- Boot:
- RESET=0时，按下Boot-下载模式
- Boot=1,正常运行
- W25Q32
- RA08-H Module | ADC KEY | Buzzer | TFT LCD 1.8 Inch SPI TO FPC | UART TO RS485 | LED Indicator
- 3.3V电源，排针
- PWR | DATA
- SP3485
- Crowtail接口
- 排针，5V&3.3V跳线帽切换电源
- 排针，UART接口 | 排针，SPI接口
- 排针，I2C接口
- LED Control
- PCA9557 ADDRESS:
- 0011 000X

## Library data of the parts
ANT1 = Lora_RA-08H_Dev:SPARKFUN2_U.FL
ANT2 = Lora_RA-08H_Dev:BU-SMA-H: FEMALE SMA CONNECTOR Radiall; OC_FARNELL: unknown; OC_NEWARK: unknown
C1-C16 C21 C24-C26 C29 C30 C32 C34-C37 = CrowBot_V1.4:A_XBJ_C0603
C27 C28 C31 C33 = CrowBot_V1.4:A_XBJ_C0805
D1 D3 = Crowtail_SIM1606:DISCRETE_007-LED*
D2 D11 = Lora_RA-08H_Dev:DISCRETE_D*
D4-D9 = Lora_RA-08H_Dev:LED: LED (Generic) Standard schematic elements and footprints for 5mm, 3mm, 1206, and 0603 sized LEDs. Generic LEDs with no color specified.
IC1 = Lora_RA-08H_Dev:PCA9557-16P
J1 J6-J12 = Crowtail_Base Shield:CONNECTER_TWIG_2.0
J2 J4 J47 J49 J50 = Lora_RA-08H_Dev:CONN_04: Multi connection point. Often used as Generic Header-pin footprint for 0.1 inch spaced/style header connections On any of the 0.1 inch spaced packages, you can populate with these: Break Away Headers - Straight <https://www.sparkfun.com/products/116> (PRT-00116) Break Away Male Headers - Right Angle <https://www.sparkfun.com/products/553> (PRT-00553) Female Headers <https://www.sparkfun.com/products/115> (PRT-00115) Break Away Headers - Machine Pin <https://www.sparkfun.com/products/117> (PRT-00117) Break Away Female Headers - Swiss Machine Pin <https://www.sparkfun.com/products/743> (PRT-00743) For SCREWTERMINALS and SPRING TERMINALS visit here: Screw Terimnals on SparkFun.com <https://www.sparkfun.com/search/results?term=Screw+Terminals> (5mm/3.5mm/2.54mm spacing) This device is also useful as a general connection point to wire up your design to another part of your project. Our various solder wires solder well into these plated through hole pads. Hook-Up Wire - Assortment (Stranded, 22 AWG) <https://www.sparkfun.com/products/11375> (PRT-11375) Hook-Up Wire - Assortment (Solid Core, 22 AWG) <https://www.sparkfun.com/products/11367> (PRT-11367) View the entire wire category on our website here <https://www.sparkfun.com/categories/141> Special notes: Molex polarized connector foot print use with SKU : PRT-08231 with associated crimp pins and housings. 1MM SMD Version SKU: PRT-10208; PROD_ID: CONN-09696
J3 = Lora_RA-08H_Dev:A_XBJ_MLT-8530
J5 J26 J27 = Lora_RA-08H_Dev:CONN_14: Multi connection point. Often used as Generic Header-pin footprint for 0.1 inch spaced/style header connections On any of the 0.1 inch spaced packages, you can populate with these: Break Away Headers - Straight <https://www.sparkfun.com/products/116> (PRT-00116) Break Away Male Headers - Right Angle <https://www.sparkfun.com/products/553> (PRT-00553) Female Headers <https://www.sparkfun.com/products/115> (PRT-00115) Break Away Headers - Machine Pin <https://www.sparkfun.com/products/117> (PRT-00117) Break Away Female Headers - Swiss Machine Pin <https://www.sparkfun.com/products/743> (PRT-00743) For SCREWTERMINALS and SPRING TERMINALS visit here: Screw Terimnals on SparkFun.com <https://www.sparkfun.com/search/results?term=Screw+Terminals> (5mm/3.5mm/2.54mm spacing) This device is also useful as a general connection point to wire up your design to another part of your project. Our various solder wires solder well into these plated through hole pads. Hook-Up Wire - Assortment (Stranded, 22 AWG) <https://www.sparkfun.com/products/11375> (PRT-11375) Hook-Up Wire - Assortment (Solid Core, 22 AWG) <https://www.sparkfun.com/products/11367> (PRT-11367) View the entire wire category on our website here <https://www.sparkfun.com/categories/141> Special notes: Molex polarized connector foot print use with SKU : PRT-08231 with associated crimp pins and housings. 1MM SMD Version SKU: PRT-10208 NOTES ON THE VARIANTS LOCK and LOCK_LONGPADS... This footprint was designed to help hold the alignment of a through-hole component (i.e. 6-pin header) while soldering it into place. You may notice that each hole has been shifted either up or down by 0.005 of an inch from it's more standard position (which is a perfectly straight line). This slight alteration caused the pins (the squares in the middle) to touch the edges of the holes. Because they are alternating, it causes a "brace" to hold the component in place. 0.005 has proven to be the perfect amount of "off-center" position when using our standard breakaway headers. Although looks a little odd when you look at the bare footprint, once you have a header in there, the alteration is very hard to notice. Also,if you push a header all the way into place, it is covered up entirely on the bottom side.
J13 = Lora_RA-08H_Dev:KF350_P3.5MM_3P
J14 = Lora_Basic_Gateway_ Module:KEVIN_TYPEC-3.0-16P-SMD
J18-J20 = Lora_RA-08H_Dev:CONN_12: Multi connection point. Often used as Generic Header-pin footprint for 0.1 inch spaced/style header connections On any of the 0.1 inch spaced packages, you can populate with these: Break Away Headers - Straight <https://www.sparkfun.com/products/116> (PRT-00116) Break Away Male Headers - Right Angle <https://www.sparkfun.com/products/553> (PRT-00553) Female Headers <https://www.sparkfun.com/products/115> (PRT-00115) Break Away Headers - Machine Pin <https://www.sparkfun.com/products/117> (PRT-00117) Break Away Female Headers - Swiss Machine Pin <https://www.sparkfun.com/products/743> (PRT-00743) For SCREWTERMINALS and SPRING TERMINALS visit here: Screw Terimnals on SparkFun.com <https://www.sparkfun.com/search/results?term=Screw+Terminals> (5mm/3.5mm/2.54mm spacing) This device is also useful as a general connection point to wire up your design to another part of your project. Our various solder wires solder well into these plated through hole pads. Hook-Up Wire - Assortment (Stranded, 22 AWG) <https://www.sparkfun.com/products/11375> (PRT-11375) Hook-Up Wire - Assortment (Solid Core, 22 AWG) <https://www.sparkfun.com/products/11367> (PRT-11367) View the entire wire category on our website here <https://www.sparkfun.com/categories/141> Special notes: Molex polarized connector foot print use with SKU : PRT-08231 with associated crimp pins and housings. 1MM SMD Version SKU: PRT-10208 NOTES ON THE VARIANTS LOCK and LOCK_LONGPADS... This footprint was designed to help hold the alignment of a through-hole component (i.e. 6-pin header) while soldering it into place. You may notice that each hole has been shifted either up or down by 0.005 of an inch from it's more standard position (which is a perfectly straight line). This slight alteration caused the pins (the squares in the middle) to touch the edges of the holes. Because they are alternating, it causes a "brace" to hold the component in place. 0.005 has proven to be the perfect amount of "off-center" position when using our standard breakaway headers. Although looks a little odd when you look at the bare footprint, once you have a header in there, the alteration is very hard to notice. Also,if you push a header all the way into place, it is covered up entirely on the bottom side.
J24 J25 J48 = Lora_RA-08H_Dev:CONN_03: Multi connection point. Often used as Generic Header-pin footprint for 0.1 inch spaced/style header connections On any of the 0.1 inch spaced packages, you can populate with these: Break Away Headers - Straight <https://www.sparkfun.com/products/116> (PRT-00116) Break Away Male Headers - Right Angle <https://www.sparkfun.com/products/553> (PRT-00553) Female Headers <https://www.sparkfun.com/products/115> (PRT-00115) Break Away Headers - Machine Pin <https://www.sparkfun.com/products/117> (PRT-00117) Break Away Female Headers - Swiss Machine Pin <https://www.sparkfun.com/products/743> (PRT-00743) Stackable Header - 3 Pin (Female, 0.1") <https://www.sparkfun.com/products/13875> (PRT-13875) For SCREWTERMINALS and SPRING TERMINALS visit here: Screw Terimnals on SparkFun.com <https://www.sparkfun.com/search/results?term=Screw+Terminals> (5mm/3.5mm/2.54mm spacing) This device is also useful as a general connection point to wire up your design to another part of your project. Our various solder wires solder well into these plated through hole pads. Hook-Up Wire - Assortment (Stranded, 22 AWG) <https://www.sparkfun.com/products/11375> (PRT-11375) Hook-Up Wire - Assortment (Solid Core, 22 AWG) <https://www.sparkfun.com/products/11367> (PRT-11367) View the entire wire category on our website here <https://www.sparkfun.com/categories/141> Special notes: Molex polarized connector foot print use with SKU : PRT-08232 with associated crimp pins and housings.; PROD_ID: XXX-00000
J46 = Lora_RA-08H_Dev:CONN_06: Multi connection point. Often used as Generic Header-pin footprint for 0.1 inch spaced/style header connections On any of the 0.1 inch spaced packages, you can populate with these: Break Away Headers - Straight <https://www.sparkfun.com/products/116> (PRT-00116) Break Away Male Headers - Right Angle <https://www.sparkfun.com/products/553> (PRT-00553) Female Headers <https://www.sparkfun.com/products/115> (PRT-00115) Break Away Headers - Machine Pin <https://www.sparkfun.com/products/117> (PRT-00117) Break Away Female Headers - Swiss Machine Pin <https://www.sparkfun.com/products/743> (PRT-00743) Arduino Stackable Header - 6 Pin <https://www.sparkfun.com/products/9280> (PRT-09280) Screw Terminals 2.54mm Pitch (6-Pin) <https://www.sparkfun.com/products/16499> (PRT-16499) For SCREWTERMINALS and SPRING TERMINALS visit here: Screw Terimnals on SparkFun.com <https://www.sparkfun.com/search/results?term=Screw+Terminals> (5mm/3.5mm/2.54mm spacing) This device is also useful as a general connection point to wire up your design to another part of your project. Our various solder wires solder well into these plated through hole pads. Hook-Up Wire - Assortment (Stranded, 22 AWG) <https://www.sparkfun.com/products/11375> (PRT-11375) Hook-Up Wire - Assortment (Solid Core, 22 AWG) <https://www.sparkfun.com/products/11367> (PRT-11367) View the entire wire category on our website here <https://www.sparkfun.com/categories/141>; PROD_ID: CONN-08437
K2-K5 = Lora_RA-08H_Dev:CROWBO_KEY_2PIN_6.5X3.5
L1 = Lora_RA-08H_Dev:DISCRETE_L*
LCD1 = Lora_RA-08H_Dev:TFT1.8_SPI_14P_PCB
P1-P4 P7-P14 = CrowBot_V1.4:CROWPI_POW_PAD*
Q1 Q2 Q5-Q18 Q24-Q31 = CrowBot_V1.4:DISCRETE_MOSFET-N: IRLL014: http://www.vishay.com/docs/91319/sihll014.pdf
Q3 Q4 = CrowBot_V1.4:DISCRETE_TRANSISTOR-NPN*: NPN audion
R1-R65 R71-R82 R87-R102 = Lora_RA-08H_Dev:DISCRETE_R*
SW1-SW3 = Lora_RA-08H_Dev:MYSMD_PB157_4.3X3
U1 = Lora_RA-08H_Dev:RP2040_RP2040: Raspberry Pi RP2040 MCU 56-pin 32-bit Microcontroller with 264kB of SRAM and external flash support up to 16MB Getting Started with the RP2040 <https://pico.raspberrypi.org/getting-started/> Dual-core ARM Cortex M0+ processor, flexible clock running up to 133 MHz 264kB of SRAM, and QSPI control of common flash memory USB 1.1 Host and Device support Low-power sleep and dormant modes Drag & drop programming using mass storage over USB 26 multi-function GPIO pins 2×SPI, 2×I2C, 2×UART, 3×12-bit ADC, 16×controllable PWM channels Accurate clock and timer on-chip Temperature sensor Accelerated floating point libraries on-chip 8×Programmable IO (PIO) state machines for custom peripheral support; PROD_ID: IC-15502
U2 = Lora_RA-08H_Dev:SELF_W25Q128JV
U3 = Lora_Basic_Gateway_ Module:LD1117-3V3-SOT223
U4 = Lora_RA-08H_Dev:RA08H_MODULE_SMD_18P
U5 = Lora_RA-08H_Dev:RS485: RS-485 Transceiver SP3485 Series 8 Pin NSOIC 3.3 V Low Power Half Duplex RS-485 Transceiver MAX3485 compatible Datasheet <http://www.sparkfun.com/datasheets/Components/General/sp3485CN-LTR.pdf> SparkFun Products SparkFun Transceiver Breakout - RS-485 <https://www.sparkfun.com/products/10124> (BOB-10124) SparkFun USB to RS-485 Converter <https://www.sparkfun.com/products/9822> (BOB-09822); PROD_ID: IC-09388
U6 = CrowBot_V1.4:CROWBOT_-V1.0-20220525_A_XBJ_HM3420B
X1 = CrowBot_V1.4:A_XBJ_XTAL

## Net classes
0 default: width 0.203 mm
1 PWR: width 0.254 mm
2 GND: width 0.203 mm
3 RS485: width 0.203 mm, clearance 0.203 mm
4 USB: width 0.203 mm, clearance 0.152 mm
5 ANT: width 0.889 mm, clearance 0.203 mm